# Altium schematic sheet Conectores.SchDoc
size A4; SheetNumber: 6; SheetTotal: 6
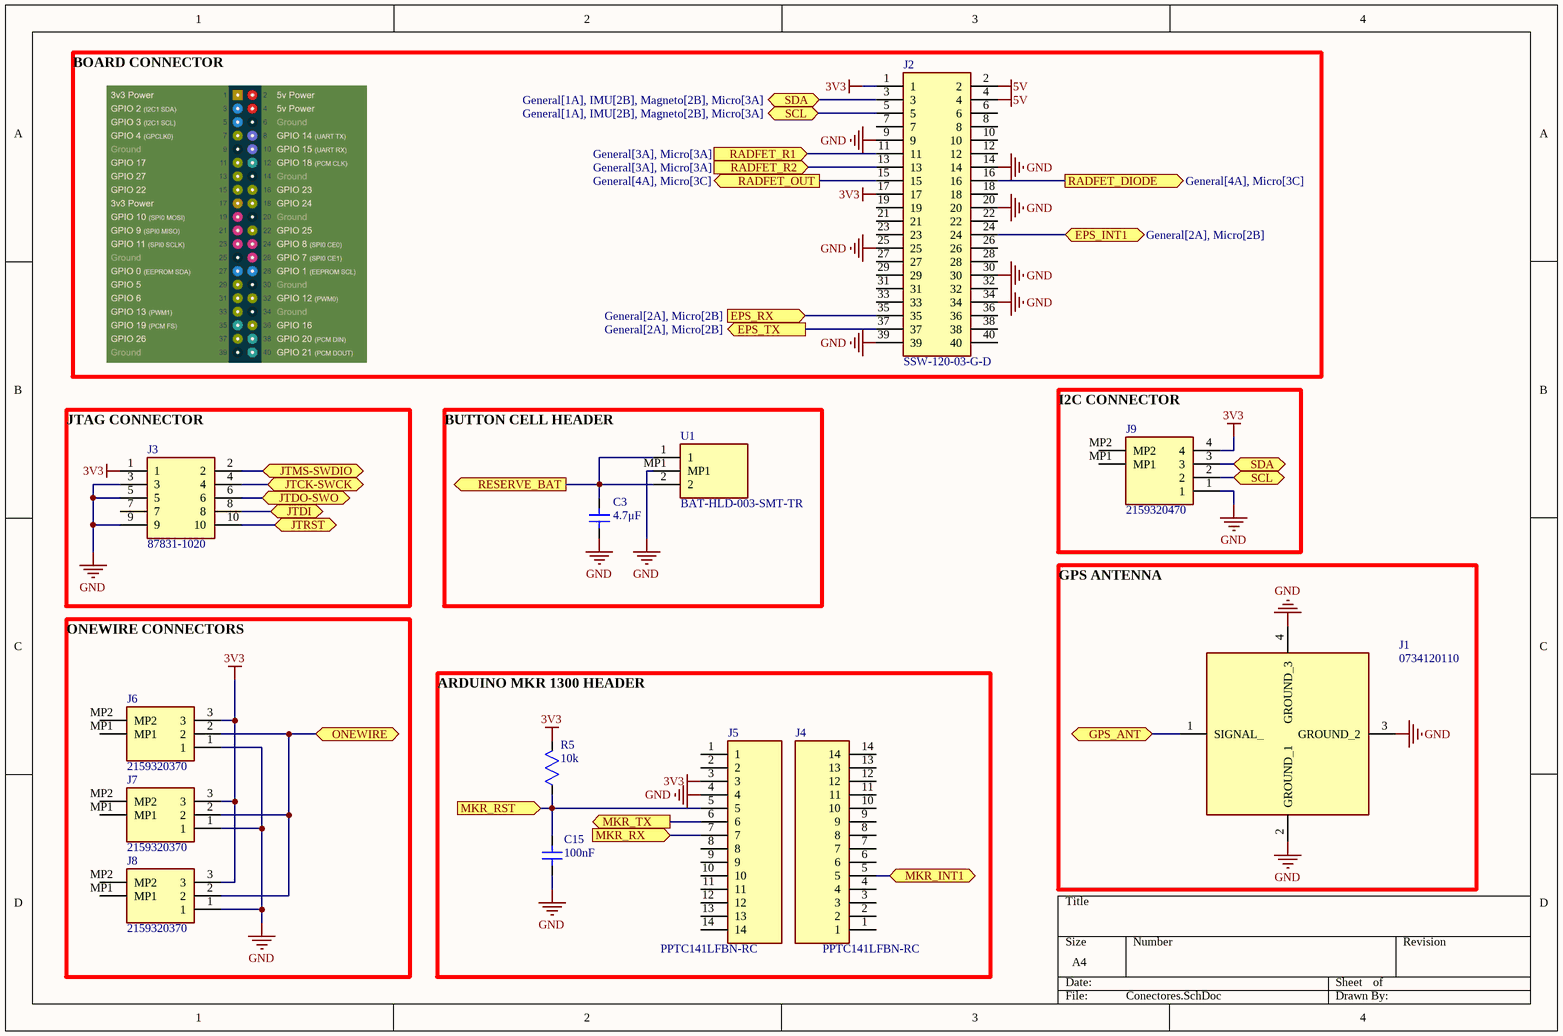
[diagram p0: Conectores.SchDoc]

## Parts
C3  Valor: 4.7μF  [CAP SMD 0805]  (hidden comment: CAP_0805_1uF)
C15  Valor: 100nF  [CAP SMD 0805]  (hidden comment: CAP_0805_100nF)
J1  0734120110  [0734120110]
J2  SSW-120-03-G-D  [RHDR40W79P254_2X20_5131X495X851P]
J3  87831-1020  [SHDR10W55P200_2X5_1265X630X640P]
J4  PPTC141LFBN-RC  [RHDR14W80P0X254_1X14_3606X254X850P]
J5  PPTC141LFBN-RC  [RHDR14W80P0X254_1X14_3606X254X850P]
J6  2159320370  [2159320370]
J7  2159320370  [2159320370]
J8  2159320370  [2159320370]
J9  2159320470  [2159320470]
R5  Valor: 10k  [RES SMD 0805]  (hidden comment: RES_0805_10k)
U1  BAT-HLD-003-SMT-TR  [BATHLD003SMTTR]

## Ports
EPS_INT1 (bidir, see General[2A], Micro[2B]), EPS_RX (in, see General[2A], Micro[2B]), EPS_TX (out, see General[2A], Micro[2B]), GPS_ANT (bidir, see General[1A], GPS_NEOM8M[4B]), JTCK-SWCK (bidir, see General[2A], Micro[2B]), JTDI (bidir, see General[2A], Micro[2B]), JTDO-SWO (bidir, see General[2A], Micro[2B]), JTMS-SWDIO (bidir, see General[1A], Micro[3A]), JTRST (bidir, see General[2A], Micro[2B]), MKR_INT1 (bidir, see General[2A], Micro[4B]), MKR_RST (in, see General[2A], Micro[4B]), MKR_RX (in, see General[2A], Micro[4B]), MKR_TX (out, see General[2A], Micro[4B]), ONEWIRE (bidir, see General[2A], Micro[4B]), RADFET_DIODE (out, see General[4A], Micro[3C]), RADFET_OUT (out, see General[4A], Micro[3C]), RADFET_R1 (in, see General[3A], Micro[3A]), RADFET_R2 (in, see General[3A], Micro[3A]), RESERVE_BAT (out, see General[1A], GPS_NEOM8M[1B], Micro[3C]), SCL (bidir, see General[1A], IMU[2B], Magneto[2B], Micro[3A]), SDA (bidir, see General[1A], IMU[2B], Magneto[2B], Micro[3A])

## Nets
3V3: J2.1 J2.17 J3.1 J5.3 J6.3 J7.3 J8.3 J9.4 R5.2
5V: J2.2 J2.4
GND: C3.2 C15.2 J1.2(GROUND_1) J1.3(GROUND_2) J1.4(GROUND_3) J2.9 J2.14 J2.20 J2.25 J2.30 J2.34 J2.39 J3.3 J3.5 J3.9 J5.4 J6.1 J7.1 J8.1 J9.1 U1.MP1
EPS_INT1: J2.24 ; port EPS_INT1
EPS_RX: J2.35 ; port EPS_RX
EPS_TX: J2.37 ; port EPS_TX
GPS_ANT: J1.1(SIGNAL_) ; port GPS_ANT
JTCK-SWCK: J3.4 ; port JTCK-SWCK
JTDI: J3.8 ; port JTDI
JTDO-SWO: J3.6 ; port JTDO-SWO
JTMS-SWDIO: J3.2 ; port JTMS-SWDIO
JTRST: J3.10 ; port JTRST
MKR_INT1: J4.5 ; port MKR_INT1
MKR_RST: C15.1 J5.5 R5.1 ; port MKR_RST
MKR_RX: J5.7 ; port MKR_RX
MKR_TX: J5.6 ; port MKR_TX
ONEWIRE: J6.2 J7.2 J8.2 ; port ONEWIRE
RADFET_DIODE: J2.16 ; port RADFET_DIODE
RADFET_OUT: J2.15 ; port RADFET_OUT
RADFET_R1: J2.11 ; port RADFET_R1
RADFET_R2: J2.13 ; port RADFET_R2
RESERVE_BAT: C3.1 U1.1 U1.2 ; port RESERVE_BAT
SCL: J2.5 J9.2 ; port SCL
SDA: J2.3 J9.3 ; port SDA

Not connected (* = marked no-connect by the designer): J2 6 7 8 10 12 18 19 21 22 23 26 27 28 29 31 32 33 36 38 40; J3 7; J4 1 2 3 4 6 7 8 9 10 11 12 13 14; J5 1 2 8 9 10 11 12 13 14; J6 MP1 MP2; J7 MP1 MP2; J8 MP1 MP2; J9 MP1 MP2

## Notes on the sheet
- (near J2) BOARD CONNECTOR
- (near J9) I2C CONNECTOR
- (near J3) JTAG CONNECTOR
- BUTTON CELL HEADER
- (near J1) GPS ANTENNA
- ONEWIRE CONNECTORS
- ARDUINO MKR 1300 HEADER

## Library data of the parts
C3 = CMP-081-000001-1: Condensador 0805 1uF; Distribuidor: -; RefFabricante: -; ComponentLink2URL: -; RefDistribuidor: -; ComponentLink2Description: Datasheet; ComponentLink1Description: Link-Compra; Design Item ID: CAP_0805_1uF; Source: ARUS2021.SchLib; Fabricante: -; ComponentLink1URL: -
C15 = CMP-081-000008-1: Condensador 0805 100nF; Fabricante: -; Design Item ID: CAP_0805_100nF; ComponentLink1URL: -; Distribuidor: -; Source: ARUS2021.SchLib; RefDistribuidor: -; RefFabricante: -; ComponentLink2URL: -; ComponentLink1Description: Link-Compra; ComponentLink2Description: Datasheet
J1 = 0734120110: Connector; Manufacturer_Name: Molex; Datasheet Link: https://www.molex.com/pdm_docs/sd/734120110_sd.pdf; Height: 1.36mm; Manufacturer_Part_Number: 0734120110; Mouser Part Number: N/A; Mouser Price/Stock: https://www.mouser.co.uk/ProductDetail/Molex/0734120110?qs=PBcRNPEHKsq%2FACQpFpzyEA%3D%3D; Arrow Part Number: 0734120110; Arrow Price/Stock: https://www.arrow.com/en/products/0734120110/molex?region=europe
J2 = SSW-120-03-G-D: Connector; Manufacturer_Name: SAMTEC; Datasheet Link: http://suddendocs.samtec.com/prints/ssw-1xx-xx-xxx-x-xx-xxx-xx-mkt.pdf; Height: 8.51mm; Manufacturer_Part_Number: SSW-120-03-G-D; Mouser Part Number: 200-SSW12003GD; Mouser Price/Stock: https://www.mouser.co.uk/ProductDetail/Samtec/SSW-120-03-G-D?qs=rU5fayqh%252BE2ll3JgDoNINQ%3D%3D; Arrow Part Number: SSW-120-03-G-D; Arrow Price/Stock: https://www.arrow.com/en/products/ssw-120-03-g-d/samtec?region=nac
J3 = CMP-138-000000-1: Header 2.00mm Milli-Grid, vert, TH, 10w Molex MILLI-GRID Series, Series Number 87831, 2mm Pitch 10 Way 2 Row Straight PCB Header, Solder Termination, 2A; Geometry.Height: 6.4mm; Arrow Price/Stock: *; Datasheet Link: https://datasheet.datasheetarchive.com/originals/distributors/SFDatasheet-1/sf-00036740.pdf; Manufacturer_Name: Molex; Design Item ID: 87831-1020; Arrow Part Number: *; Mouser Price/Stock: https://www.mouser.co.uk/ProductDetail/Molex/87831-1020?qs=8PELaTI4Pt8k%2F%2FV9vKeYIg%3D%3D; Source: 87831-1020.SchLib; Mouser Part Number: 538-87831-1020; Manufacturer_Part_Number: 87831-1020
J4 J5 = PPTC141LFBN-RC: Connector; Manufacturer_Name: Sullins; Datasheet Link: http://www.sullinscorp.com/drawings/78_P(N)PxCxxxLFBN-RC,_10492-H.pdf; Height: 8.5mm; Manufacturer_Part_Number: PPTC141LFBN-RC
J6-J8 = 2159320370: Connector; Manufacturer_Name: Molex; Datasheet Link: https://www.molex.com/pdm_docs/sd/2159320370_sd.pdf; Height: 7.5mm; Manufacturer_Part_Number: 2159320370
J9 = 2159320470: Connector; Manufacturer_Name: Molex; Datasheet Link: https://www.molex.com/webdocs/datasheets/pdf/en-us/2159320470_PCB_HEADERS.pdf; Height: 7.5mm; Manufacturer_Part_Number: 2159320470
R5 = CMP-088-000003-1: Resistencia 0805 10k; Distribuidor: -; Fabricante: -; Design Item ID: RES_0805_10k; ComponentLink1Description: Link-Compra; RefDistribuidor: -; ComponentLink2Description: Datasheet; Source: ARUS2021.SchLib; ComponentLink1URL: -; RefFabricante: -; ComponentLink2URL: -
U1 = BAT-HLD-003-SMT-TR: Undefined or Miscellaneous; Manufacturer_Name: Linx Technologies; Datasheet Link: https://linxtechnologies.com/wp/wp-content/uploads/bat-hld-003-smt-ds.pdf; Height: 4.2mm; Manufacturer_Part_Number: BAT-HLD-003-SMT-TR; Mouser Part Number: 712-BAT-HLD-003SMTTR; Mouser Price/Stock: https://www.mouser.co.uk/ProductDetail/Linx-Technologies/BAT-HLD-003-SMT-TR?qs=TuK3vfAjtkVhl445ZsgJ1g%3D%3D